# Altium project Clase3_Harness.PrjPcb
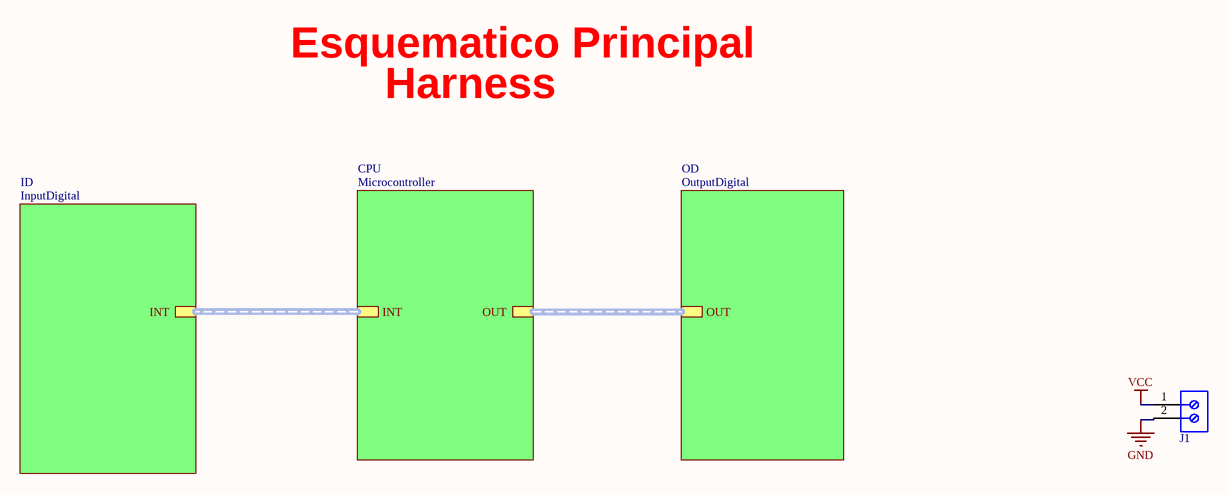
[diagram p0: MAIN.SchDoc]
2 sheets, 2 parts. Net scope: hierarchical (ports join the sheet entries above them; power ports are global).
Board file: PCB1.PcbDoc
Sheets:
  MAIN.SchDoc
    CPU = Microcontroller.SchDoc

## Sheet MAIN.SchDoc
size A4; SheetNumber: 1; SheetTotal: 4

### Parts
J1  691214110002  [691214110002]  (value not drawn)

### Sub-sheets
CPU = Microcontroller: INT, OUT
ID = InputDigital (file not in this document): INT
OD = OutputDigital (file not in this document): OUT

### Nets
GND: J1.2
VCC: J1.1

### Buses and harness runs
harness sheet CPU/INT = sheet ID/INT
harness sheet CPU/OUT = sheet OD/OUT

### Notes on the sheet
- Esquematico Principal
- Harness

### Library data of the parts
J1 = CMP-1502-02464-1: Serie 2141 - 3.50 mm Horizontal Entry Modular with Rising Cage Clamp WR-TBL, 2 pin; Manufacturer: Wurth Elektronik; Pin Number: 2; Pitch: 3.50mm; Datasheet URL: http://katalog.we-online.de/em/datasheet/6912141100xx.pdf; Packaging: Box; Mounting Technology: THT; Package Reference: 691214110002; Manufacturer URL: http://www.we-online.de; Part Number: 691214110002; Publisher: WurthElektronik; Operating Temperature: -40to105degC

## Sheet Microcontroller.SchDoc
size A4; SheetNumber: 3; SheetTotal: 4
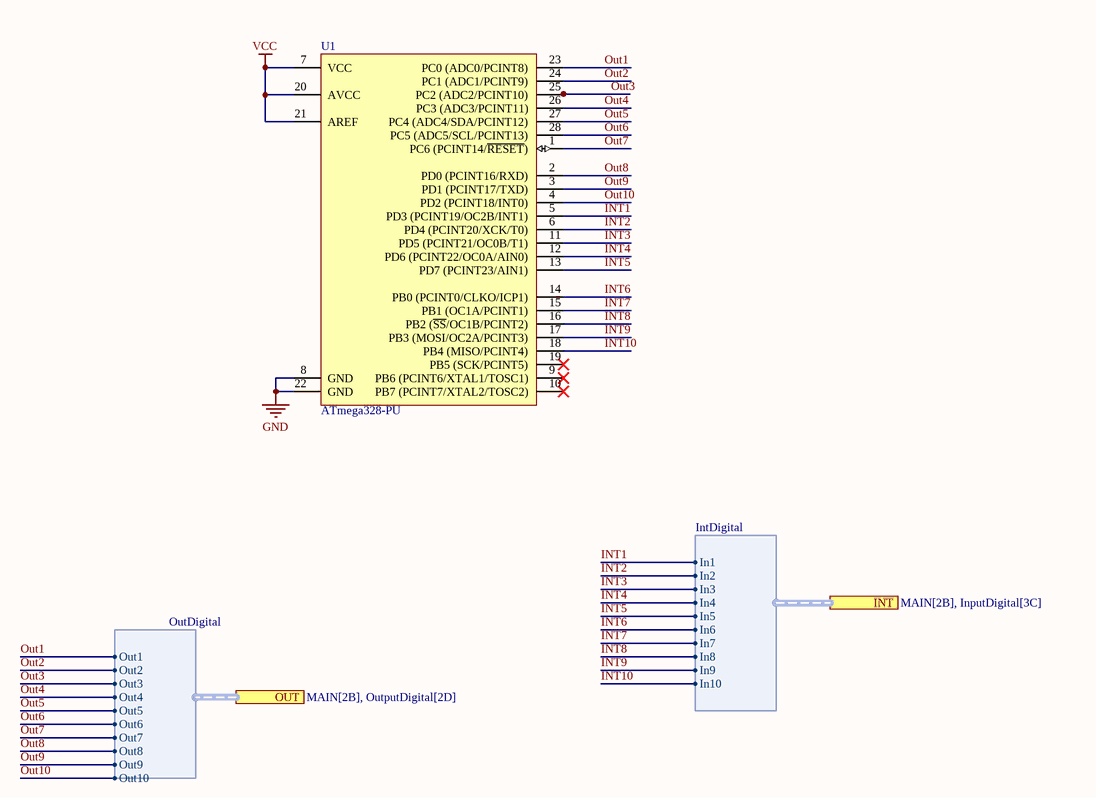
[diagram p1: Microcontroller.SchDoc]

### Parts
U1  ATmega328-PU  [28P3]

### Ports
INT (harness IntDigital, see MAIN[2B], InputDigital[3C]), OUT (harness OutDigital, see MAIN[2B], OutputDigital[2D])

### Harnesses
IntDigital: In1, In2, In3, In4, In5, In6, In7, In8, In9, In10
OutDigital: Out1, Out2, Out3, Out4, Out5, Out6, Out7, Out8, Out9, Out10

### Nets
GND: U1.8(GND) U1.22(GND)
VCC: U1.7(VCC) U1.20(AVCC) U1.21(AREF)
INT1: U1.5(PD3_(PCINT19/OC2B/INT1)) ; port INT.In1
INT2: U1.6(PD4_(PCINT20/XCK/T0)) ; port INT.In2
INT3: U1.11(PD5_(PCINT21/OC0B/T1)) ; port INT.In3
INT4: U1.12(PD6_(PCINT22/OC0A/AIN0)) ; port INT.In4
INT5: U1.13(PD7_(PCINT23/AIN1)) ; port INT.In5
INT6: U1.14(PB0_(PCINT0/CLKO/ICP1)) ; port INT.In6
INT7: U1.15(PB1_(OC1A/PCINT1)) ; port INT.In7
INT8: U1.16(PB2_(~{SS}/OC1B/PCINT2)) ; port INT.In8
INT9: U1.17(PB3_(MOSI/OC2A/PCINT3)) ; port INT.In9
INT10: U1.18(PB4_(MISO/PCINT4)) ; port INT.In10
Out1: U1.23(PC0_(ADC0/PCINT8)) ; port OUT.Out1
Out2: U1.24(PC1_(ADC1/PCINT9)) ; port OUT.Out2
Out3: U1.25(PC2_(ADC2/PCINT10)) ; port OUT.Out3
Out4: U1.26(PC3_(ADC3/PCINT11)) ; port OUT.Out4
Out5: U1.27(PC4_(ADC4/SDA/PCINT12)) ; port OUT.Out5
Out6: U1.28(PC5_(ADC5/SCL/PCINT13)) ; port OUT.Out6
Out7: U1.1(PC6_(PCINT14/~{RESET})) ; port OUT.Out7
Out8: U1.2(PD0_(PCINT16/RXD)) ; port OUT.Out8
Out9: U1.3(PD1_(PCINT17/TXD)) ; port OUT.Out9
Out10: U1.4(PD2_(PCINT18/INT0)) ; port OUT.Out10

Not connected (* = marked no-connect by the designer): U1 9(PB6_(PCINT6/XTAL1/TOSC1))* 10(PB7_(PCINT7/XTAL2/TOSC2))* 19(PB5_(SCK/PCINT5))*

### Library data of the parts
U1 = CMP-0095-00015-2: 8-bit AVR Microcontroller, 32KB Flash, 1KB EEPROM, 2KB SRAM, 28-pin PDIP, Industrial Grade (-40°C to 85°C); ComponentLink3Description: ATmega48A/48PA/88A/88PA/168A/168PA/328/328P Summary; RevisionNote: DatasheetVersion updated. URLs added.; DatasheetVersion: revD, May-2011; ComponentLink1URL: http://www.atmel.com/; PackageVersion: revB, Sep-2001; PackageDescription: 28-lead (0.300"/7.62mm Wide) Plastic Dual Inline Package (PDIP); PackageReference: 28P3; ComponentLink1Description: Manufacturer URL; ComponentLink2Description: ATmega48A/48PA/88A/88PA/168A/168PA/328/328P Datasheet; ComponentLink3URL: http://www.atmel.com/dyn/resources/prod_documents/8271S.pdf; ComponentLink2URL: http://www.atmel.com/dyn/resources/prod_documents/8271.pdf

## Nets that join several sheets
GND: MAIN (J1.2), Microcontroller (U1.8 U1.22)
VCC: MAIN (J1.1), Microcontroller (U1.7 U1.20 U1.21)